# EAGLE design Power_Board (EAGLE 6.4)
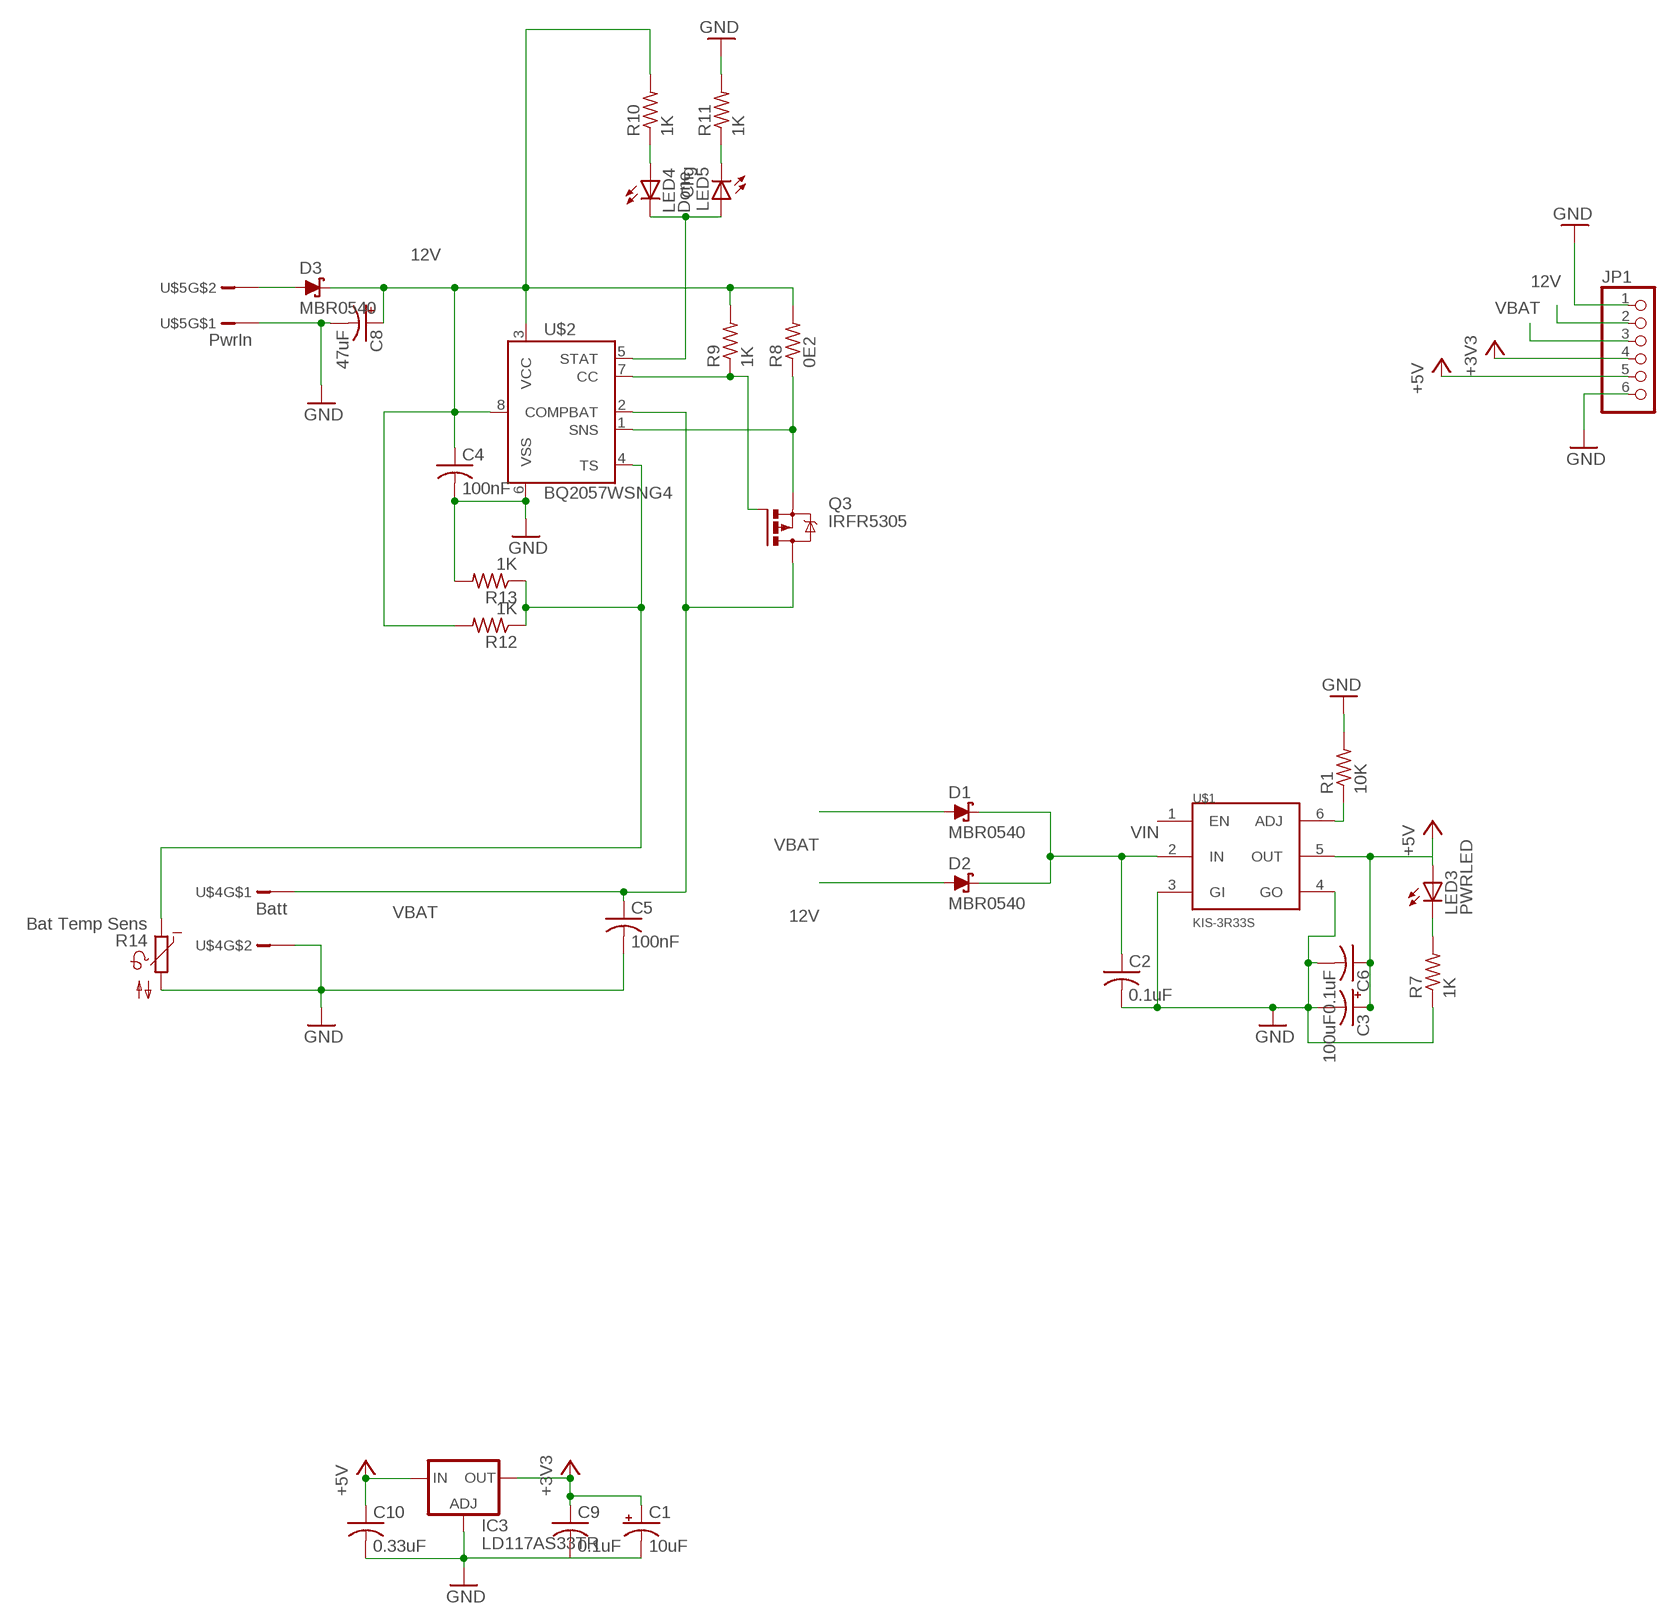
[diagram p0: schematic, sheet 1]

## Parts
C1  10uF  CPOL-USE2.5-7  [E2,5-7]
C2  0.1uF  C-USC0805K  [C0805K]
C3  100uF  CPOL-USE2.5-7  [E2,5-7]
C4  100nF  C-USC0805K  [C0805K]
C5  100nF  C-USC0805K  [C0805K]
C6  0.1uF  C-USC0805K  [C0805K]
C8  47uF  CPOL-USE2.5-7  [E2,5-7]
C9  0.1uF  C-USC0805K  [C0805K]
C10  0.33uF  C-USC0805K  [C0805K]
D1  MBR0540  [SOD123]
D2  MBR0540  [SOD123]
D3  MBR0540  [SOD123]
IC3  LD117AS33TR  [SOT223]
JP1  PINHD-1X6  [1X06]
LED3  PWRLED  LEDCHIPLED_0805  [CHIPLED_0805]
LED4  Done  LEDCHIPLED_0805  [CHIPLED_0805]
LED5  Chg  LEDCHIPLED_0805  [CHIPLED_0805]
Q3  IRFR5305  [D-PAK_TO252AA]
R1  10K  R-US_R0805  [R0805]
R7  1K  R-US_R0805  [R0805]
R8  0E2  R-US_M1206  [M1206]
R9  1K  R-US_R0805  [R0805]
R10  1K  R-US_R0805  [R0805]
R11  1K  R-US_R0805  [R0805]
R12  1K  R-US_R0805  [R0805]
R13  1K  R-US_R0805  [R0805]
R14  Bat Temp Sens  NTC640  [P640]
U$1  KIS-3R33S  [KIS-3R33S]
U$2  BQ2057WSNG4  [D_R-PDSO-G8]
U$4  Batt  JST_PHR-2  [PHR-2]
U$5  PwrIn  JST_PHR-2  [PHR-2]

## Nets
12V: C4.1 C8.+ D2.A D3.C JP1.2 R8.2 R9.2 R10.2 R12.2 U$2.3(VCC) U$2.8(COMP)
+3V3: C1.+ C9.1 IC3.4(OUT) JP1.4
+5V: C3.+ C6.1 C10.1 IC3.3(IN) JP1.5 LED3.A U$1.5(OUT)
GND: C1.- C2.2 C3.- C4.2 C5.2 C6.2 C8.- C9.2 C10.2 IC3.1(ADJ) JP1.1 JP1.6 R1.2 R7.1 R11.2 R13.2 R14.2 U$1.3(GI) U$1.4(GO) U$2.6(VSS) U$4.P$2 U$5.P$1
N$2: R1.1 U$1.6(ADJ)
N$6: LED3.C R7.2
N$8: LED4.C LED5.A U$2.5(STAT)
N$11: LED4.A R10.1
N$17: D3.A U$5.P$2
N$27: Q3.3(S) R8.1 U$2.1(SNS)
N$29: Q3.1(G) R9.1 U$2.7(CC)
N$30: LED5.C R11.1
N$32: R12.1 R13.1 R14.1 U$2.4(TS)
VBAT: C5.1 D1.A JP1.3 Q3.4(D) U$2.2(BAT) U$4.P$1
VIN: C2.1 D1.C D2.C U$1.2(IN)
Unconnected: U$1.1(EN)

## Library data of the parts
C1 C3 C8 = resistor:CPOL-US: POLARIZED CAPACITOR, American symbol
C2 C4-C6 C9 C10 = resistor:C-US: CAPACITOR, American symbol
D1-D3 = diode:MBR0540: schottky diode, 0.5A, 40V ON Semiconductor
IC3 = v-reg:LD117A?*: Low drop fixed and adjustable positive voltage regulators 1 A Source: http://www.st.com/stonline/products/literature/ds/7194/ld1117axx.pdf
JP1 = pinhead:PINHD-1X6: PIN HEADER
LED3-LED5 = led:LED: LED OSRAM: - CHIPLED LG R971, LG N971, LY N971, LG Q971, LY Q971, LO R971, LY R971 LH N974, LH R974 LS Q976, LO Q976, LY Q976 LO Q996 - Hyper CHIPLED LW Q18S LB Q993, LB Q99A, LB R99A - SideLED LS A670, LO A670, LY A670, LG A670, LP A670 LB A673, LV A673, LT A673, LW A673 LH A674 LY A675 LS A676, LA A676, LO A676, LY A676, LW A676 LS A679, LY A679, LG A679 - Hyper Micro SIDELED® LS Y876, LA Y876, LO Y876, LY Y876 LT Y87S - SmartLED LW L88C, LW L88S LB L89C, LB L89S, LG L890 LS L89K, LO L89K, LY L89K LS L896, LA L896, LO L896, LY L896 - TOPLED LS T670, LO T670, LY T670, LG T670, LP T670 LSG T670, LSP T670, LSY T670, LOP T670, LYG T670 LG T671, LOG T671, LSG T671 LB T673, LV T673, LT T673, LW T673 LH T674 LS T676, LA T676, LO T676, LY T676, LB T676, LH T676, LSB T676, LW T676 LB T67C, LV T67C, LT T67C, LS T67K, LO T67K, LY T67K, LW E67C LS E67B, LA E67B, LO E67B, LY E67B, LB E67C, LV E67C, LT E67C LW T67C LS T679, LY T679, LG T679 LS T770, LO T770, LY T770, LG T770, LP T770 LB T773, LV T773, LT T773, LW T773 LH T774 LS E675, LA E675, LY E675, LS T675 LS T776, LA T776, LO T776, LY T776, LB T776 LHGB T686 LT T68C, LB T68C - Hyper Mini TOPLED® LB M676 - Mini TOPLED Santana® LG M470 LS M47K, LO M47K, LY M47K Source: http://www.osram.convergy.de LUXEON: - LUMILED® LXK2-PW12-R00, LXK2-PW12-S00, LXK2-PW14-U00, LXK2-PW14-V00 LXK2-PM12-R00, LXK2-PM12-S00, LXK2-PM14-U00 LXK2-PE12-Q00, LXK2-PE12-R00, LXK2-PE12-S00, LXK2-PE14-T00, LXK2-PE14-U00 LXK2-PB12-K00, LXK2-PB12-L00, LXK2-PB12-M00, LXK2-PB14-N00, LXK2-PB14-P00, LXK2-PB14-Q00 LXK2-PR12-L00, LXK2-PR12-M00, LXK2-PR14-Q00, LXK2-PR14-R00 LXK2-PD12-Q00, LXK2-PD12-R00, LXK2-PD12-S00 LXK2-PH12-R00, LXK2-PH12-S00 LXK2-PL12-P00, LXK2-PL12-Q00, LXK2-PL12-R00 Source: www.luxeon.com KINGBRIGHT: KA-3528ASYC Source: www.kingbright.com
Q3 = transistor-power:IRF?5305: HEXFET Power MOSFET Source: http://www.irf.com/product-info/datasheets/data/irfr5305pbf.pdf
R1 R7-R13 = resistor:R-US_: RESISTOR, American symbol
R14 = ptc-ntc:NTC640: PHILIPS NTC; OC_FARNELL: unknown; OC_NEWARK: unknown
U$1 = KIS-3R33S:KIS-3R33S: DC-DC Converter
U$2 = RobThePyro:BQ2057WSNG4: TI BQ2057WSNG4 1-2Cell Li-ion / lipo charger IC http://www.ti.com/lit/ds/symlink/bq2057w.pdf
U$4 U$5 = RobThePyro:JST_PHR-2

## Net classes
0 default: width 0.152 mm, drill 0.305 mm, clearance 0.152 mm

## Board
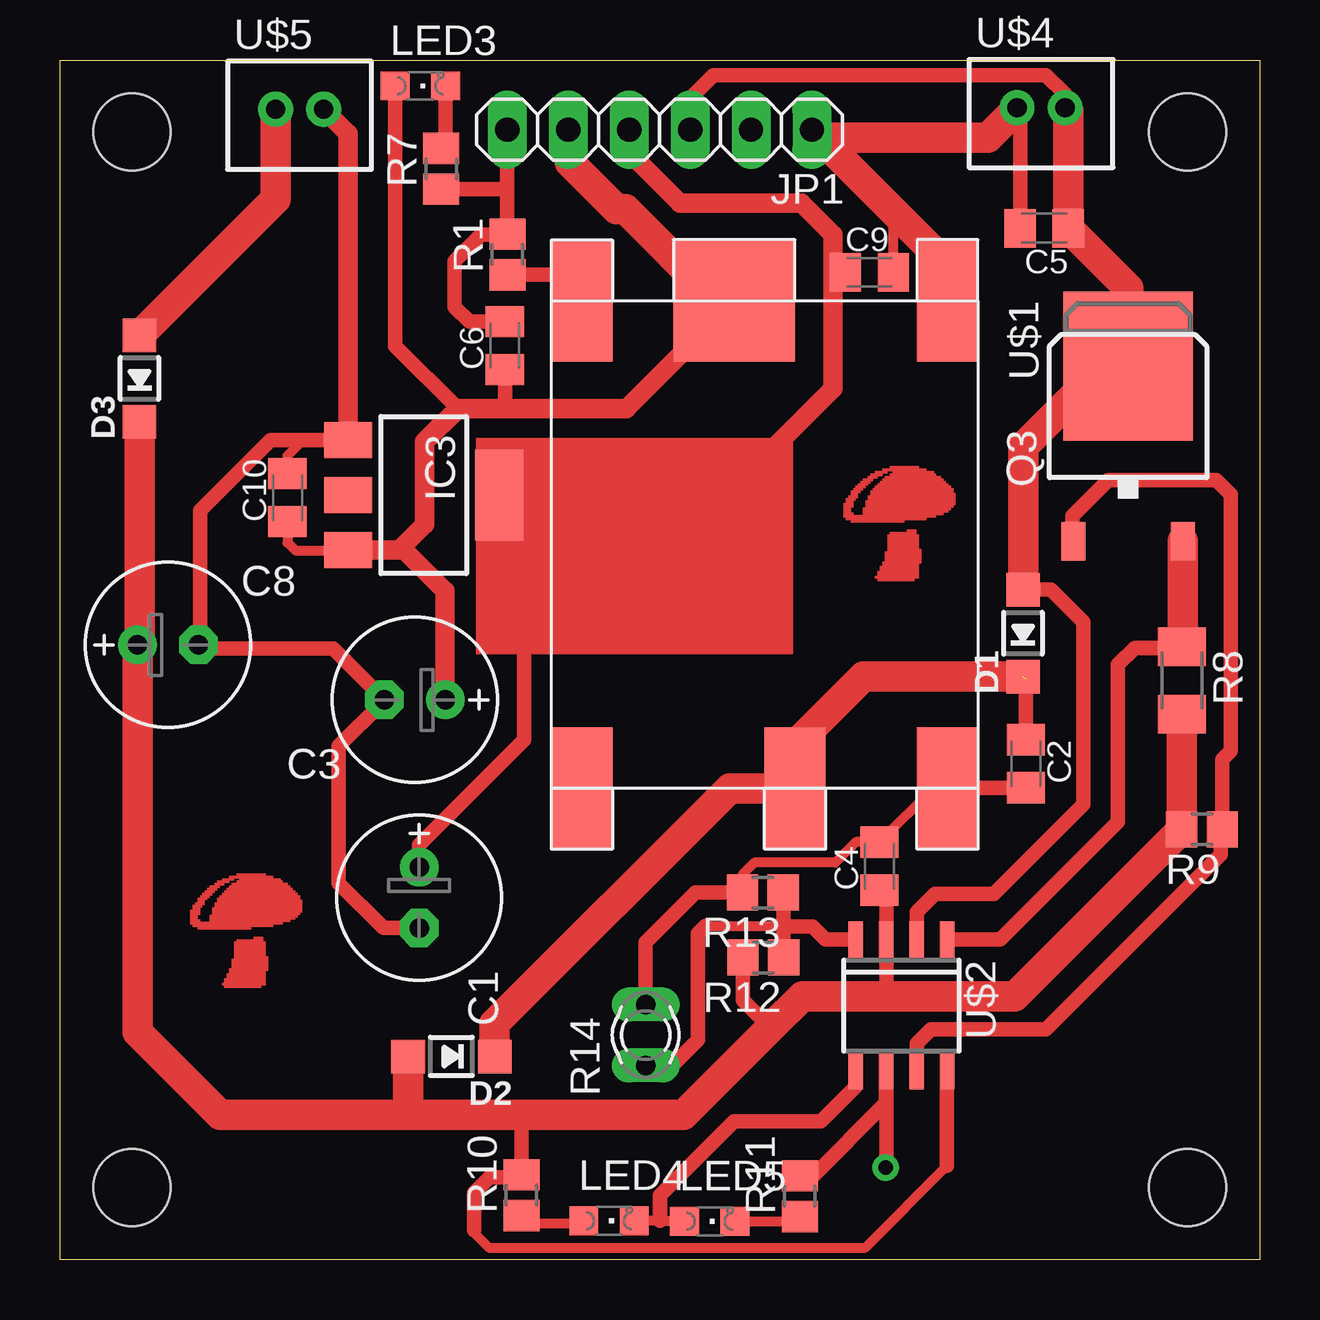
[diagram p1: board, top side]
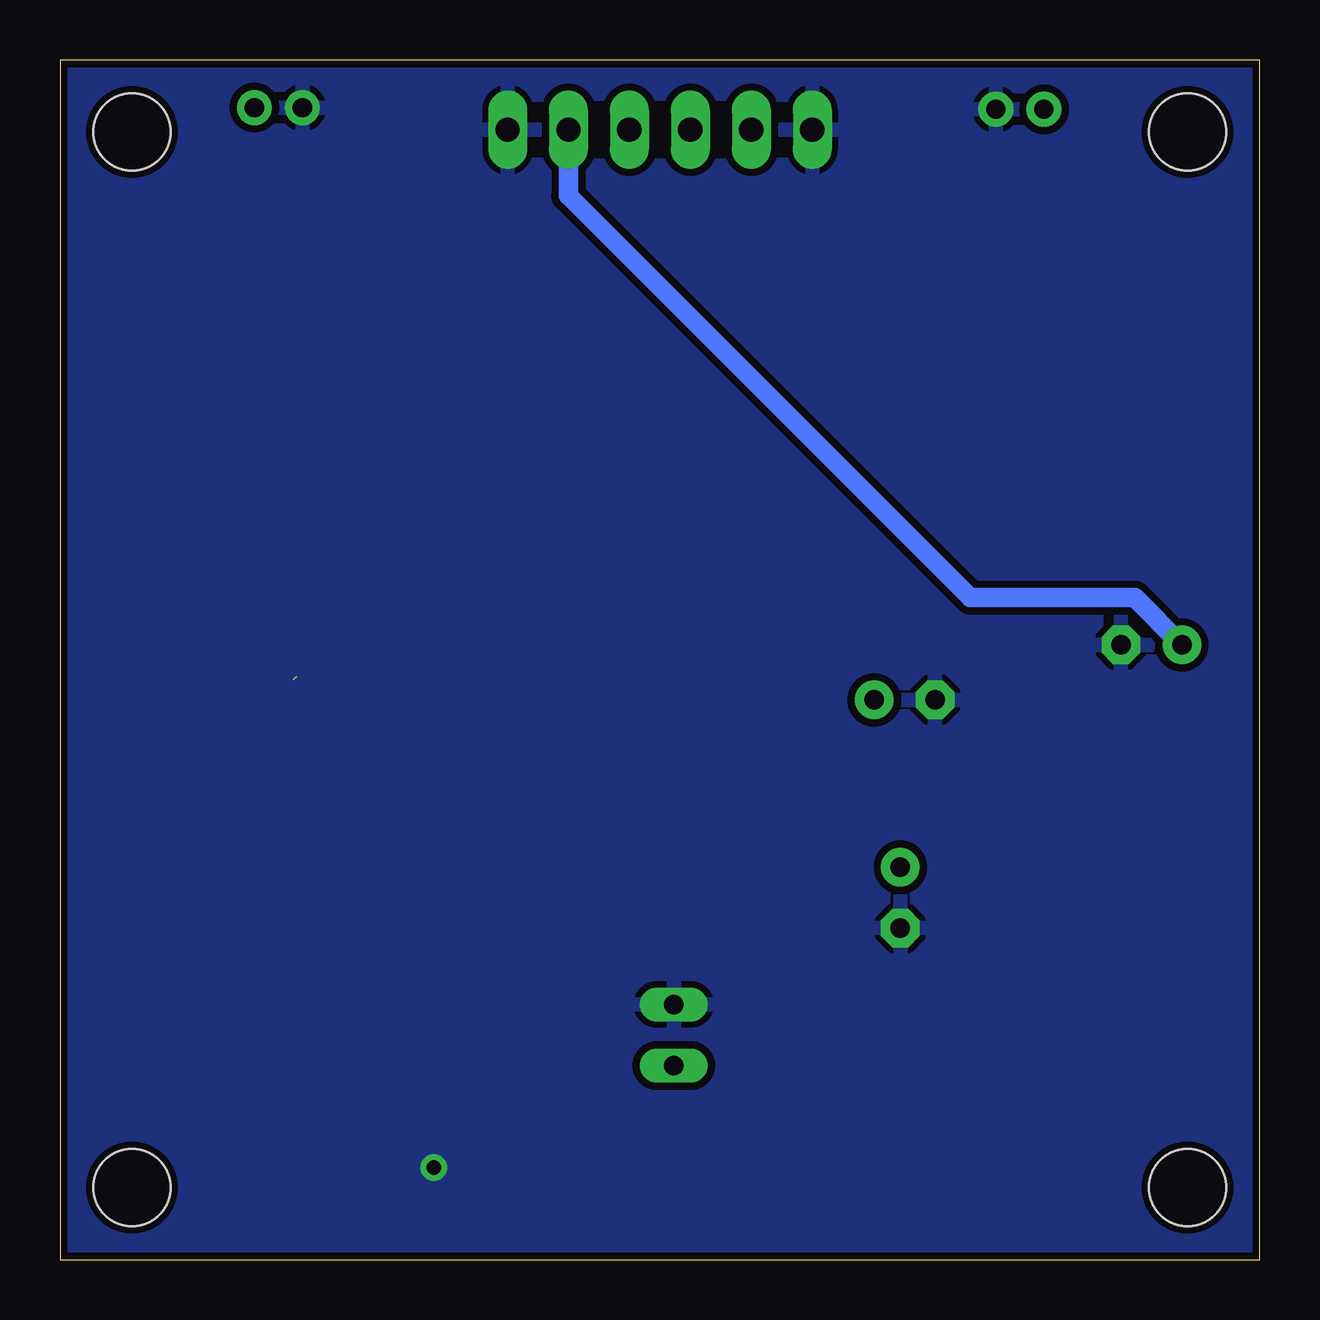
[diagram p2: board, bottom side, seen from below]

Size 50 x 50 mm. Coordinates in mm from the lower left corner, seen from the top.
Outline: 0,0 0,50 50,50 50,0 0,0
Copper layers (1*16): Top 0.035mm / dielectric 1.5mm / Bottom 0.035mm
Design rules "SparkFun": minimum track width 8mil, minimum drill 20mil, track to track 8mil, track to pad 8mil, pad to pad 8mil, via to via 8mil, smd to smd 8mil, copper to edge 10mil, drill to drill 8mil, minimum pad ring 12mil, minimum via ring 10mil, stop-mask expansion 4mil, vias tented up to drill 25mil, thermal gap 10mil
Holes 3.2 mm at 3,3 3,47 47,47 47,3

### Footprints (pad centres in the part's own frame; a part is rotated, then mirrored left to right if it is on the bottom)
E2,5-7 = drill 0.813 pad 1.6: + -1.27,0 | drill 0.813 pad 1.6 octagon: - 1.27,0
C0805K = smd 1.3 x 1.6: 1 -1,0; 2 1,0
SOD123 = smd 1.4 x 1.4: A 1.805,0; C -1.805,0
SOT223 = smd 1.5 x 2: 1 -2.3,-3.15; 2 0,-3.15; 3 2.3,-3.15 | smd 3.8 x 2: 4 0,3.15
1X06 = drill 1.016 long: 1 -6.35,0; 2 -3.81,0; 3 -1.27,0; 4 1.27,0; 5 3.81,0; 6 6.35,0
CHIPLED_0805 = smd 1.2 x 1.2: A 0,-1.05; C 0,1.05
D-PAK_TO252AA = smd 1 x 1.6: 1 -2.28,-4.8; 3 2.28,-4.8 | smd 5.4 x 6.2: 4 0,2.5
R0805 = smd 1.3 x 1.5: 1 -0.85,0; 2 0.85,0
M1206 = smd 1.6 x 2: 1 -1.4,0; 2 1.4,0
P640 = drill 0.813 long: 1 -1.27,0; 2 1.27,0
KIS-3R33S = smd 5.08 x 2.54: 1 10.16,-7.62; 2 10.16,1.27; 3 10.16,7.62; 4 -10.16,7.62; 6 -10.16,-7.62 | smd 5.08 x 5.08: 5 -10.16,-1.27
D_R-PDSO-G8 = smd 0.6 x 1.5: 1 -1.905,-2.75; 2 -0.635,-2.75; 3 0.635,-2.75; 4 1.905,-2.75; 5 1.905,2.75; 6 0.635,2.75; 7 -0.635,2.75; 8 -1.905,2.75
PHR-2 = drill 0.8 pad 1.45: P$1 1,0; P$2 -1,0

### Placement (x,y rotation side)
C1  14.97,15.08 270 top
C2  40.26,20.66 270 top
C3  14.79,23.33 180 top
C4  34.16,16.4 90 top
C5  41.02,42.98 180 top
C6  18.54,38.09 90 top
C8  4.5,25.62 0 top
C9  33.74,41.14 0 top
C10  9.49,31.76 90 top
D1  40.14,26.1 90 top
D2  16.31,8.46 180 top
D3  3.31,36.72 90 top
IC3  15.16,31.86 270 top
JP1  24.99,47.09 180 top
LED3  15.02,48.92 270 top
LED4  22.88,1.61 270 top
LED5  27.08,1.59 270 top
Q3  44.52,34.74 0 top
R1  18.65,41.89 90 top
R7  15.89,45.46 90 top
R8  46.76,24.13 270 top
R9  47.6,17.93 180 top
R10  19.23,2.68 90 top
R11  30.83,2.64 90 top
R12  29.32,12.59 180 top
R13  29.3,15.3 180 top
R14  24.42,9.36 90 top
U$1  29.37,29.8 270 top
U$2  35.07,10.58 180 top
U$4  40.89,48.01 0 top
U$5  9.98,47.94 0 top

### Tracks (layer width: path | path; a pad name or v marks a point on that pad's centre or on a via)
12V
  Top 0.406: 17.27,1.21 17.27,1.12 17.89,0.49 33.56,0.49 36.98,3.91
  Top 0.61: U$2.8 36.98,3.91 | 17.27,1.21 17.27,2.79 17.9,3.42 19.22,3.42 R10.2 19.23,5.56 19.69,6.02 | 3.25,15.52 3.23,15.5 | C4.1 34.44,15.18 U$2.3 34.44,11.02 34.39,10.97 | R12.2 28.47,10.81 29.62,9.65
  Top 1.27: D3.C 3.31,25.7 C8.+ 3.23,15.5 3.23,9.46 6.67,6.02 14.44,6.02 | R8.2 R9.2 39.79,10.97 34.39,10.97 30.94,10.97 29.62,9.65 25.99,6.02 19.69,6.02 14.44,6.02 | D2.A 14.51,6.09 14.44,6.02
  Bottom 0.813: JP1.2 28.8,44.34 12.04,27.58 5.19,27.58 C8.+
+3V3
  Top 0.406: C9.1 32.41,41.14 32.22,41.32
  Top 0.61: C1.+ 14.97,17.27 19.35,21.65 19.35,30.82 IC3.4
  Top 0.813: IC3.4 27.78,31.86 32.22,36.3 32.22,41.32 32.22,42.71 30.91,44.02 25.85,44.02 23.78,46.09 23.78,47.03 JP1.4
+5V
  Top 0.406: C10.1 9.49,29.88 9.81,29.55 12,29.55 IC3.3
  Top 0.61: LED3.A 13.97,38.08 16.58,35.47 | C6.1 18.54,35.56 18.45,35.47
  Top 0.813: IC3.3 14.12,29.56 14.24,29.68 | 14.24,29.68 15.19,30.63 15.19,34.08 16.58,35.47 18.45,35.47 23.61,35.47 U$1.5 | C3.+ 16.06,27.85 14.24,29.68
  Top 1.27: U$1.5 27.37,39.96 23.56,43.77 23.2,43.77 21.26,45.71 21.26,47.01 JP1.5
GND  (via drill 0.6)
  Top 0.406: U$1.3 36.4,19.64 C4.2 33.17,17.4 32.31,16.54 28.95,16.54 28.45,16.04 R13.2 | C9.2 34.74,43.66 34.76,43.68 | C10.2 9.49,33.51 10.14,34.16 IC3.1
  Top 0.61: R11.2 31.31,3.39 34.44,6.52 U$2.6 34.44,3.85 v34.42,3.83 | C2.2 37.83,19.66 37.34,20.15 37.34,19.99 U$1.3 | C5.2 40.02,47.88 U$4.P$2 | JP1.6 18.64,44.59 | 18.64,44.59 R1.2 18.62,42.71 17.54,42.71 16.45,41.62 16.45,39.7 17.06,39.09 C6.2 | R14.2 24.42,13.23 26.49,15.3 R13.2 | R7.1 18.63,44.61 18.64,44.59 | IC3.1 8.78,34.16 5.84,31.22 5.84,25.46 11.38,25.46 C3.- | C1.- 13.48,13.81 11.62,15.67 11.62,21.4 13.44,23.22
  Top 0.813: IC3.1 12.01,46.92 U$5.P$1
  Top 1.27: U$1.4 36.99,41.44 34.76,43.68 31.67,46.76 | 31.67,46.76 JP1.1 | 31.67,46.76 38.67,46.76 39.9,47.99 39.9,48.04 39.88,48.06
  Bottom 0.61: v34.42,3.83 34.42,3.81 34.46,3.77
  pour Bottom (isolate 0.305): -0.01,49.99 -0.01,-0.01 49.99,-0.01 49.99,49.99
N$2
  Top 0.61: R1.1 20.67,41.04 U$1.6
N$6
  Top 0.61: LED3.C 16.07,46.5 R7.2
N$8
  Top 0.406: LED5.A 26.01,1.61 25.01,1.61 LED4.C
  Top 0.61: 26.01,1.51 LED5.A | U$2.5 33.17,7.21 31.72,5.76 28.09,5.76 25.01,2.69 25.01,1.61
N$11
  Top 0.406: 19.45,1.51 21.73,1.51 LED4.A
  Top 0.61: 19.45,1.51 R10.1
N$17
  Top 1.27: U$5.P$2 8.98,44.2 D3.A
N$27
  Top 0.61: 36.98,13.68 U$2.1 39.19,13.33 44.09,18.23 44.09,24.79 44.79,25.49 46.72,25.49 R8.1
  Top 1.27: R8.1 46.8,25.57 Q3.3
N$29
  Top 0.61: 42.15,29.85 Q3.1 42.19,29.99 42.19,30.99 43.69,32.49 48.19,32.49 48.79,31.89 48.79,21.19 48.45,20.85 R9.1 48.39,17.87 48.39,16.89 41.09,9.59 36.29,9.59 35.71,9.01 U$2.7
N$30
  Top 0.406: LED5.C 30.63,1.59 R11.1
  Top 0.61: 30.63,1.49 R11.1
N$32
  Top 0.406: 26.91,13.91 29.99,13.91 30.15,13.75
  Top 0.61: 30.15,13.91 R13.1 30.28,15.43 | 30.15,13.91 30.15,13.75 30.15,12.61 R12.1 | U$2.4 31.92,13.33 31.36,13.89 30.17,13.89 30.15,13.91 | R14.1 25.53,8.09 26.6,9.16 26.6,13.6 26.91,13.91
VBAT
  Top 0.61: U$2.2 35.71,14.49 36.46,15.24 38.92,15.24 42.65,18.97 42.65,26.56 41.29,27.92 40.16,27.92 D1.A | U$4.P$1 41.89,48.58 41.1,49.37 27.24,49.37 26.26,48.39 JP1.3
  Top 1.27: D1.A 40.15,27.92 40.15,33.88 43.51,37.24 Q3.4 44.52,40.48 C5.1 42.02,47.88 U$4.P$1
VIN  (2 unrouted)
  Top 0.61: C2.1 40.26,24.18
  Top 1.27: D1.C 33.49,24.3 30.64,21.45 U$1.2 27.92,19.64 18.12,9.84 D2.C
(copper drawn outside any net)
  shapes: Top area x125